# EAGLE design zif_a1 (EAGLE 5.11)
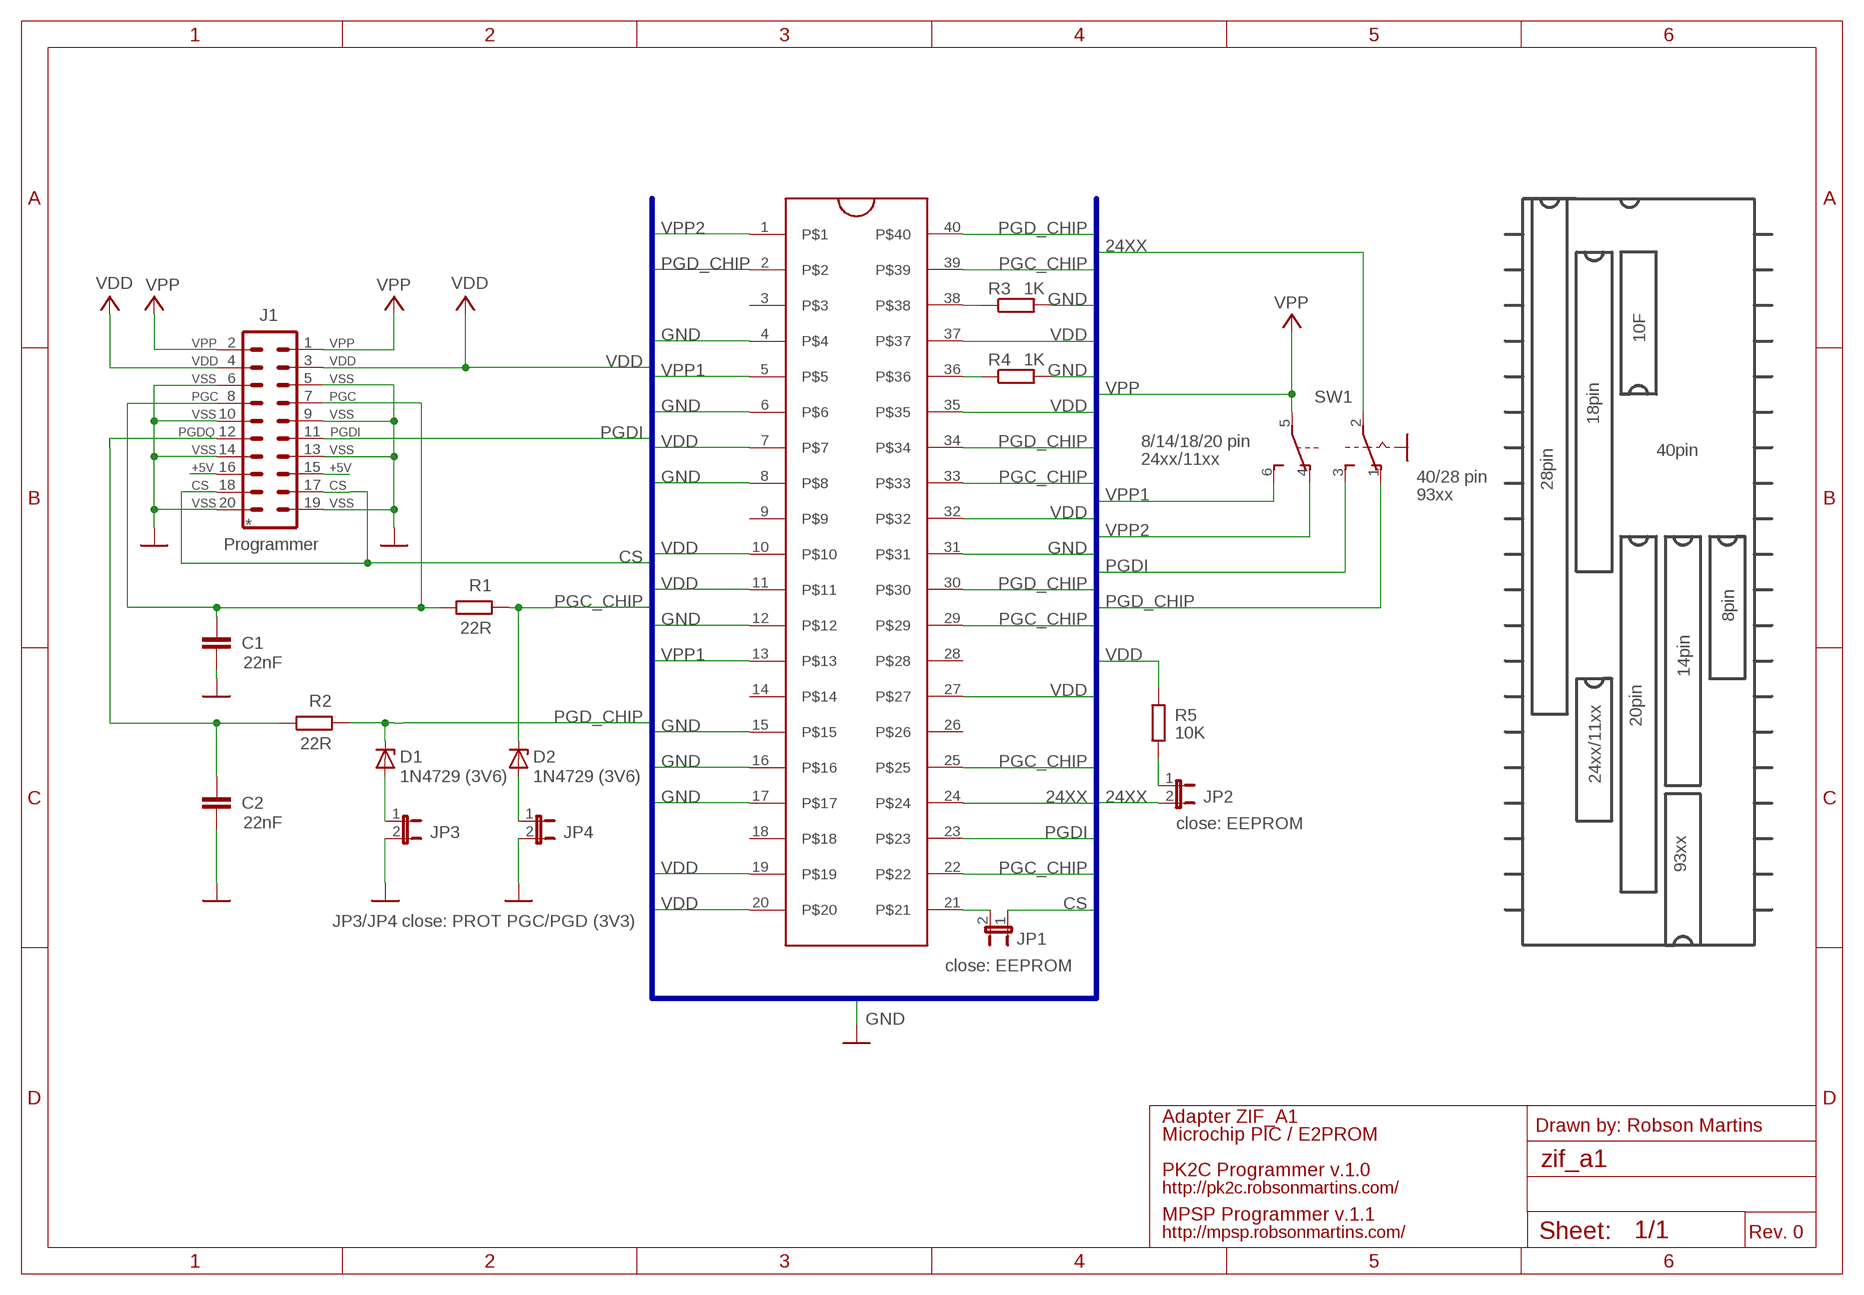
[diagram p0: schematic, sheet 1]

## Parts
C1  22nF  C-EU025-025X050  [C025-025X050]
C2  22nF  C-EU025-025X050  [C025-025X050]
D1  1N4729 (3V6)  1N4728  [DO41Z10]
D2  1N4729 (3V6)  1N4728  [DO41Z10]
J1  Programmer  MA10-2  [MA10-2]
JP1  JP1E  [JP1]
JP2  JP1E  [JP1]
JP3  JP1E  [JP1]
JP4  JP1E  [JP1]
R1  22R  R-EU_0204/7  [0204/7]
R2  22R  R-EU_0204/7  [0204/7]
R3  1K  R-EU_0204/7  [0204/7]
R4  1K  R-EU_0204/7  [0204/7]
R5  10K  R-EU_0204/7  [0204/7]
SW1  A68-A31  [A68-A31]
U$1  40 pin ZIF  ZIFSOCKET-40-6DIL40-6-ZIF_SOCKET  [DIL40-6-ZIF_SOCKET]

## Nets
24XX: JP2.2 SW1.2(A:P) U$1.24
+5V: J1.15 J1.16
CS: J1.17 J1.18 JP1.1
GND: C1.2 C2.2 J1.5 J1.6 J1.9 J1.10 J1.13 J1.14 J1.19 J1.20 JP3.2 JP4.2 R3.2 R4.2 U$1.4 U$1.6 U$1.8 U$1.12 U$1.15 U$1.16 U$1.17 U$1.31
JP_24XX: JP2.1 R5.1
JP_PROT_PGC: D2.A JP4.1
JP_PROT_PGD: D1.A JP3.1
PGC: C1.1 J1.7 J1.8 R1.1
PGC_CHIP: D2.C R1.2 U$1.22 U$1.25 U$1.29 U$1.33 U$1.39
PGD_CHIP: D1.C R2.2 SW1.1(A:O) U$1.2 U$1.30 U$1.34 U$1.40
PGDI: J1.11 SW1.3(A:S) U$1.23
PGDQ: C2.1 J1.12 R2.1
PIN21: JP1.2 U$1.21
PIN36: R4.1 U$1.36
PIN38: R3.1 U$1.38
VDD: J1.3 J1.4 R5.2 U$1.7 U$1.10 U$1.11 U$1.19 U$1.20 U$1.27 U$1.32 U$1.35 U$1.37
VPP: J1.1 J1.2 SW1.5(B:P)
VPP1: SW1.6(B:S) U$1.5 U$1.13
VPP2: SW1.4(B:O) U$1.1
Unconnected: U$1.3 U$1.9 U$1.14 U$1.18 U$1.26 U$1.28

## Buses
B$1

## Notes on the sheet
- 10F
- VPP | VPP
- VDD | VDD
- VSS | VSS
- PGC | PGC
- VSS | VSS
- 18pin
- PGDQ | PGDI
- 8/14/18/20 pin
- VSS | VSS | 40pin
- 24xx/11xx
- +5V | +5V
- 40/28 pin
- CS | CS | 28pin
- 93xx
- VSS | VSS
- *
- 8pin
- 14pin
- 20pin
- 24xx/11xx
- close: EEPROM
- 93xx
- JP3/JP4 close: PROT PGC/PGD (3V3)
- close: EEPROM
- Adapter ZIF_A1
- Drawn by: Robson Martins
- Microchip PIC / E2PROM
- PK2C Programmer v.1.0
- http://pk2c.robsonmartins.com/
- MPSP Programmer v.1.1
- http://mpsp.robsonmartins.com/ | Rev. 0

## Library data of the parts
C1 C2 = rcl:C-EU: CAPACITOR, European symbol
D1 D2 = diode:1N4728: Z DIODE 3.3 V, 1W, 5 percent
J1 = con-lstb:MA10-2: PIN HEADER; OC_FARNELL: unknown; OC_NEWARK: unknown
JP1-JP4 = jumper:JP1E: JUMPER
R1-R5 = resistor:R-EU_: RESISTOR, European symbol
SW1 = switch:A68-A31: SLIDING SWITCH Siemens, distributor Buerklin, 11G766
U$1 = SparkFun:ZIFSOCKET-40-6

## Board
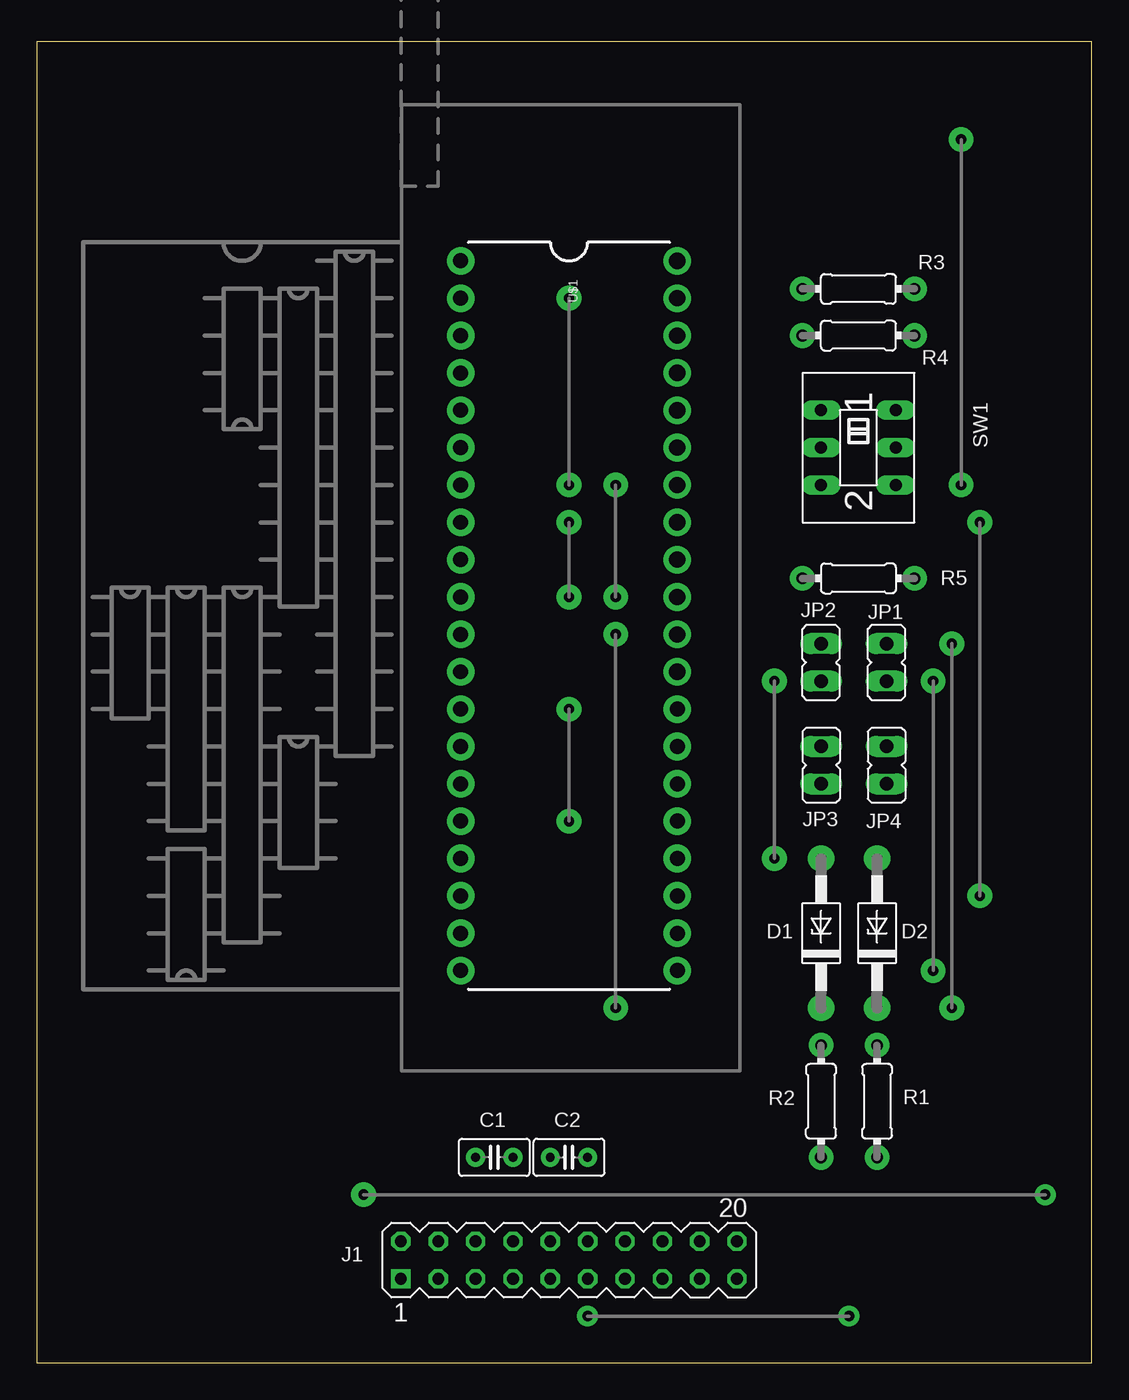
[diagram p1: board, top side]
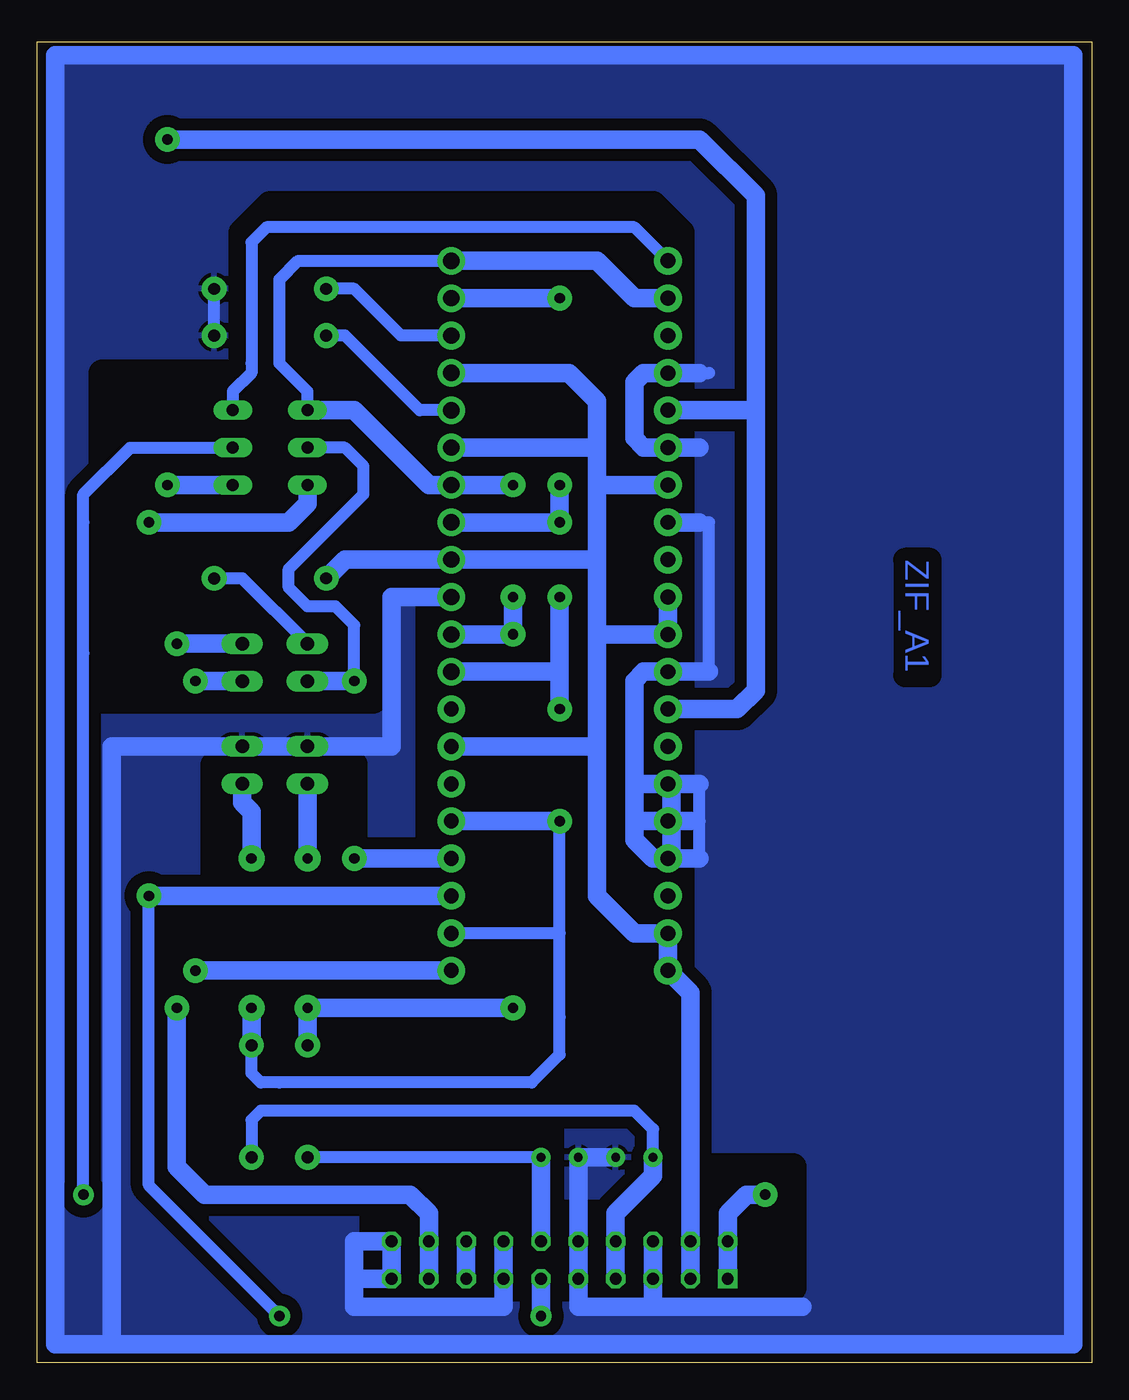
[diagram p2: board, bottom side, seen from below]

Size 71.73 x 89.84 mm. Coordinates in mm from the lower left corner, seen from the top.
Outline: 0,0 71.73,0 71.73,89.84 0,89.84 0,0
Copper layers (1*16): Top 0.035mm / dielectric 1.5mm / Bottom 0.035mm
Design rules "default": minimum track width 10mil, minimum drill 24mil, track to track 8mil, track to pad 8mil, pad to pad 8mil, via to via 8mil, smd to smd 8mil, copper to edge 40mil, drill to drill 8mil, minimum pad ring 10mil, minimum via ring 8mil, stop-mask expansion 4mil, vias tented up to drill 0mil, thermal gap 10mil
bRestrict: area 20.3,5.1 to 48.9,15.9; area 56.5,11.4 to 62.9,26.7; area 27.9,26 to 67.3,78.7; area 50.2,31.8 to 59.7,40.6

### Footprints (pad centres in the part's own frame; a part is rotated, then mirrored left to right if it is on the bottom)
C025-025X050 = drill 0.6 pad 1.27 round: 1 -1.27,0; 2 1.27,0
DO41Z10 = drill 0.7 pad 1.778 round: A 5.08,0; C -5.08,0
MA10-2 = drill 0.8 pad 1.27 square: 1 -11.43,-1.27 | drill 0.8 pad 1.27 octagon: 2 -11.43,1.27; 3 -8.89,-1.27; 4 -8.89,1.27; 5 -6.35,-1.27; 6 -6.35,1.27; 7 -3.81,-1.27; 8 -3.81,1.27; 9 -1.27,-1.27; 10 -1.27,1.27; 11 1.27,-1.27; 12 1.27,1.27; 13 3.81,-1.27; 14 3.81,1.27; 15 6.35,-1.27; 16 6.35,1.27; 17 8.89,-1.27; 18 8.89,1.27; 19 11.43,-1.27; 20 11.43,1.27
JP1 = drill 0.914 long: 1 0,-1.27; 2 0,1.27
0204/7 = drill 0.813 pad 1.676 round: 1 -3.81,0 | drill 0.8 pad 1.676 round: 2 3.81,0
A68-A31 = drill 0.813 long: 1 -2.54,-2.54; 2 0,-2.54; 3 2.54,-2.54; 4 -2.54,2.54; 5 0,2.54; 6 2.54,2.54
DIL40-6-ZIF_SOCKET = drill 1.016 pad 1.88 round: 1 -24.13,-7.366; 2 -21.59,-7.366; 3 -19.05,-7.366; 4 -16.51,-7.366; 5 -13.97,-7.366; 6 -11.43,-7.366; 7 -8.89,-7.366; 8 -6.35,-7.366; 9 -3.81,-7.366; 10 -1.27,-7.366; 11 1.27,-7.366; 12 3.81,-7.366; 13 6.35,-7.366; 14 8.89,-7.366; 15 11.43,-7.366; 16 13.97,-7.366; 17 16.51,-7.366; 18 19.05,-7.366; 19 21.59,-7.366; 20 24.13,-7.366; 21 24.13,7.366; 22 21.59,7.366; 23 19.05,7.366; 24 16.51,7.366; 25 13.97,7.366; 26 11.43,7.366; 27 8.89,7.366; 28 6.35,7.366 | drill 1.1 pad 1.88 round: 29 3.81,7.366; 30 1.27,7.366; 31 -1.27,7.366; 32 -3.81,7.366; 33 -6.35,7.366; 34 -8.89,7.366; 35 -11.43,7.366; 36 -13.97,7.366; 37 -16.51,7.366; 38 -19.05,7.366; 39 -21.59,7.366; 40 -24.13,7.366

### Placement (x,y rotation side)
C1  31.11,13.97 0 top
C2  36.2,13.97 180 top
D1  53.34,29.21 90 top
D2  57.15,29.21 90 top
J1  36.2,6.99 0 top
JP1  57.78,47.62 180 top
JP2  53.34,47.62 180 top
JP3  53.34,40.64 0 top
JP4  57.78,40.64 0 top
R1  57.15,17.78 90 top
R2  53.34,17.78 90 top
R3  55.88,73.03 0 top
R4  55.88,69.85 0 top
R5  55.88,53.34 180 top
SW1  55.88,62.23 270 top
U$1  36.2,50.8 270 top

### Tracks (layer width: path | path; a pad name or v marks a point on that pad's centre or on a via)
24XX  (via drill 0.7 pad 1.68)
  Top 0.254: v50.16,34.29 v50.16,46.35
  Bottom 0.813: SW1.2 50.8,62.23 49.53,60.96 49.53,59.05 54.61,53.98 54.61,52.7 53.34,51.44 | 51.44,51.44 53.34,51.44 | 51.44,51.44 53.34,51.44 | v50.16,46.35 50.16,50.16 51.44,51.44
  Bottom 1.27: v50.16,46.35 JP2.2 | U$1.24 v50.16,34.29
+5V
  Bottom 1.27: J1.15 J1.16
CS  (via drill 0.7 pad 1.68)
  Top 0.254: v62.23,24.13 v62.23,48.9
  Bottom 1.27: J1.17 J1.18 45.09,10.16 46.35,11.43 60.33,11.43 62.23,13.34 v62.23,24.13 | JP1.1 61.59,48.9 v62.23,48.9
GND
  Bottom 0.813: R4.2 R3.2 | 28.57,62.23 U$1.6 29.84,62.23 | 29.21,67.31 U$1.4 | U$1.4 27.3,67.31 | 27.3,67.31 26.67,67.31 | 29.21,67.31 U$1.4 | U$1.4 27.3,67.31 | 27.3,67.31 26.67,67.31 | 26.67,67.31 26.04,67.31 | 27.94,57.15 U$1.8 29.21,57.15 | 26.67,57.15 26.04,57.15 26.04,46.99 | 28.57,34.29 27.94,34.29 28.57,34.29 | 26.67,34.29 26.67,36.83 | 26.67,36.83 26.67,39.37 | 26.67,36.83 27.3,36.83 28.57,36.83 U$1.16 | 28.57,39.37 U$1.15 | U$1.15 29.21,39.37 U$1.15 | 30.48,34.92 29.84,34.29 U$1.17 | 28.57,34.29 U$1.17 | 29.84,36.83 30.48,36.83 | 29.21,67.31 U$1.4 | U$1.4 26.67,67.31 | 28.57,34.29 U$1.17 | 29.21,46.99 U$1.12 29.21,46.99
  Bottom 1.27: J1.20 J1.19 49.53,5.71 | J1.14 J1.13 40.01,3.81 50.16,3.81 50.16,8.26 J1.20 | J1.6 J1.5 29.84,3.81 | C1.2 C2.2 J1.10 J1.9 34.92,3.81 29.84,3.81 | 19.68,3.81 29.84,3.81 | J1.20 49.53,8.26 | U$1.31 45.72,52.07 47.62,52.07 47.62,41.91 48.26,41.91 JP3.2 JP4.2 66.67,41.91 66.67,1.27 | 26.67,62.23 28.57,62.23 | 29.21,67.31 30.48,67.31 31.11,66.67 31.11,63.5 31.11,62.87 30.48,62.23 29.84,62.23 U$1.6 | 26.67,57.15 27.94,57.15 U$1.8 | U$1.12 26.04,46.99 | 28.57,39.37 28.57,36.83 28.57,34.29 29.84,34.29 31.11,35.56 31.11,36.83 | 26.67,34.29 27.94,34.29 | 26.67,39.37 28.57,39.37 | U$1.4 26.67,67.31 | 28.57,39.37 U$1.15 29.21,39.37 29.84,39.37 31.11,39.37 | 27.3,36.83 U$1.16 29.84,36.83 31.11,36.83 | 29.21,46.99 30.48,46.99 31.11,46.35 31.11,39.37 | 31.11,36.83 31.11,39.37 | 66.67,1.27 1.27,1.27 1.27,88.9 70.48,88.9 70.48,71.12 70.48,1.27 66.67,1.27
  pour Bottom (isolate 0.813): 0,0 71.75,0 71.75,90.17 0,90.17
JP_24XX
  Bottom 0.813: JP2.1 57.78,53.34 R5.1
JP_PROT_PGC
  Bottom 1.27: D2.A 57.15,37.47 57.78,38.1 JP4.1
JP_PROT_PGD
  Bottom 1.27: D1.A JP3.1
PGC
  Bottom 0.813: C1.1 29.84,15.88 31.11,17.14 33.02,17.14 54.61,17.14 56.52,17.14 57.15,16.51 R1.1
  Bottom 1.27: J1.7 J1.8 32.38,10.16 29.84,12.7 C1.1
PGC_CHIP  (via drill 0.7 pad 1.68)
  Top 0.254: v36.2,52.07 v36.2,57.15 | v36.2,36.83 v36.2,44.45 | v36.2,59.69 v36.2,72.39
  Bottom 0.813: U$1.22 40.64,29.21 36.2,29.21 | 36.2,29.21 36.2,23.5 36.2,20.95 38.1,19.05 55.24,19.05 56.52,19.05 57.15,19.68 R1.2 | 36.2,29.21 v36.2,36.83
  Bottom 1.27: U$1.25 39.37,36.83 v36.2,36.83 | U$1.33 v36.2,57.15 v36.2,59.69 | v36.2,72.39 U$1.39 | D2.C 57.15,22.86 R1.2 | v36.2,52.07 36.2,50.8 36.2,49.53 36.2,46.99 | v36.2,44.45 36.2,46.99 | 36.2,46.99 U$1.29
PGD_CHIP  (via drill 0.7 pad 1.68)
  Top 0.254: v39.37,52.07 v39.37,59.69 | v39.37,24.13 v39.37,49.53
  Bottom 0.813: U$1.40 53.98,74.93 55.24,73.66 55.24,68.58 55.24,67.94 53.34,66.04 SW1.1
  Bottom 1.27: R2.2 D1.C 50.16,24.13 40.64,24.13 v39.37,24.13 | U$1.40 33.66,74.93 31.11,72.39 U$1.2 | SW1.1 50.16,64.77 45.09,59.69 U$1.34 40.64,59.69 v39.37,59.69 | U$1.30 40.64,49.53 v39.37,49.53 v39.37,52.07
PGDI  (via drill 0.7 pad 1.42, 0.7 pad 1.68)
  Top 0.254: v37.47,3.17 v55.24,3.17 | v64.14,31.75 v64.14,57.15
  Bottom 0.813: v64.14,31.75 64.14,12.06 v55.24,3.17
  Bottom 1.27: SW1.3 53.34,58.42 54.61,57.15 62.23,57.15 v64.14,57.15 | v37.47,3.17 J1.11 | v64.14,31.75 U$1.23
PGDQ
  Bottom 0.813: C2.1 R2.1
  Bottom 1.27: J1.12 C2.1
PIN21  (via drill 0.7 pad 1.68)
  Top 0.254: v60.96,26.67 v60.96,46.35
  Bottom 1.27: U$1.21 46.99,26.67 v60.96,26.67 | JP1.2 59.69,46.35 v60.96,46.35
PIN36
  Bottom 0.813: R4.1 50.8,69.85 45.72,64.77 U$1.36
PIN38
  Bottom 0.813: R3.1 50.16,73.03 46.99,69.85 U$1.38
VDD
  Bottom 1.27: J1.3 J1.4 27.3,25.15 U$1.20 U$1.19 31.11,29.21 32.38,30.48 33.66,31.75 33.66,39.37 33.66,41.91 | U$1.27 37.47,41.91 33.66,41.91 | 33.66,49.53 33.66,54.61 | 33.66,49.53 U$1.11 U$1.10 | 33.66,54.61 U$1.32 47.62,54.61 50.8,54.61 R5.2 | 31.11,59.69 U$1.7 | 31.11,59.69 32.38,59.69 | U$1.37 35.56,67.31 33.66,65.41 33.66,62.23 | 33.66,59.69 31.11,59.69 | 33.66,54.61 33.66,59.69 | 33.66,62.23 U$1.35 | 33.66,41.91 33.66,48.26 33.66,49.53 | 33.66,59.69 33.66,62.23
VPP  (via drill 0.7 pad 1.42, 0.7 pad 1.68)
  Top 0.254: v22.23,11.43 v68.58,11.43
  Bottom 0.813: v68.58,11.43 68.58,48.26 68.58,57.15 68.58,59.05 65.41,62.23 SW1.5 | J1.1 J1.2 J1.1
  Bottom 1.27: J1.1 24.77,10.16 23.5,11.43 v22.23,11.43
VPP1  (via drill 0.7 pad 1.68)
  Top 0.254: v62.87,83.19 v62.87,59.69
  Bottom 1.27: U$1.13 24.13,44.45 22.86,45.72 22.86,63.5 22.86,64.77 | v62.87,59.69 SW1.6 | 22.86,64.77 22.86,79.38 26.67,83.19 v62.87,83.19 | 22.86,64.77 U$1.5
VPP2
  Bottom 0.813: SW1.4 58.42,66.04 57.15,67.31 57.15,67.94 57.15,76.2 56.13,77.22 31.11,77.22 U$1.1

### Text on the board
Bottom: ZIF_A1
tDocu: ZIF_A1 Adapter | PIC 40pin | 93xx | PIC 18pin | PIC10F | 40/28pin | PIC 28pin | 24xx/11xx | 8/14/18/20pin | PIC 8pin | PIC 14pin | JP1/JP2: | EEPROM | PIC 20pin | 24x/11x | JP3/JP4: | PROT PGD/PGC | 93xx | Microchip PIC | 24xx/11xx/93xx | VSS | VPP | VDD | VSS | PGC | VSS | PGD | VSS | +5V | CS